# EAGLE design PressureSensor-Breakout-v0 (EAGLE 9.6.2)
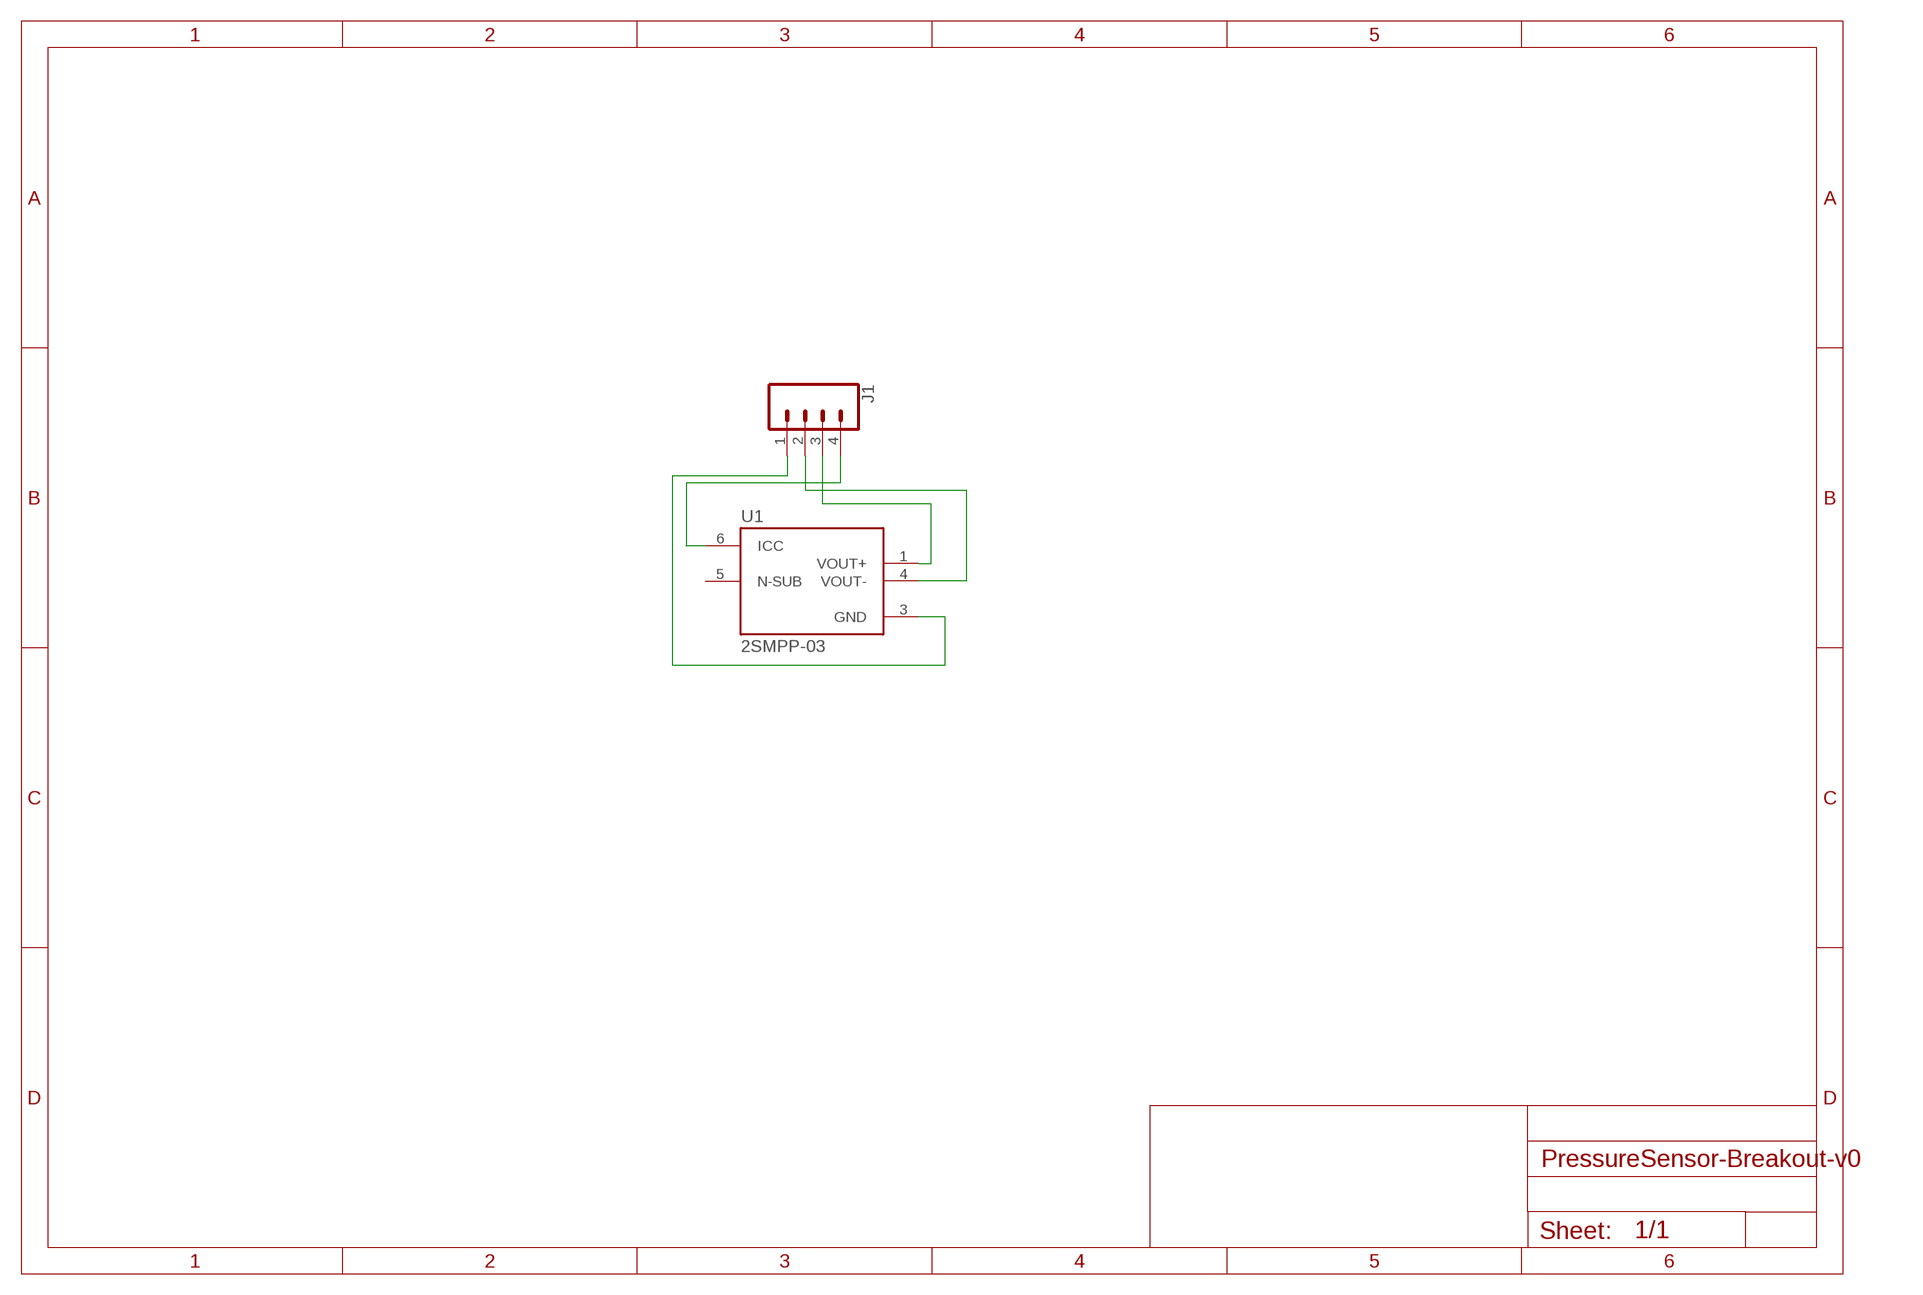
[diagram p0: schematic, sheet 1]

## Parts
J1  CONN_04  [1X04]
U1  2SMPP-03  [XDCR_2SMPP-03]

## Nets
N$1 [JLC PCB]: J1.2 U1.4(VOUT-)
N$2 [JLC PCB]: J1.4 U1.6(ICC)
N$3 [JLC PCB]: J1.1 U1.3(GND)
N$4 [JLC PCB]: J1.3 U1.1(VOUT+)
Unconnected: U1.5(N-SUB)

## Library data of the parts
J1 = ULN2803ADW:CONN_04: Multi connection point. Often used as Generic Header-pin footprint for 0.1 inch spaced/style header connections On any of the 0.1 inch spaced packages, you can populate with these: Break Away Headers - Straight <https://www.sparkfun.com/products/116> (PRT-00116) Break Away Male Headers - Right Angle <https://www.sparkfun.com/products/553> (PRT-00553) Female Headers <https://www.sparkfun.com/products/115> (PRT-00115) Break Away Headers - Machine Pin <https://www.sparkfun.com/products/117> (PRT-00117) Break Away Female Headers - Swiss Machine Pin <https://www.sparkfun.com/products/743> (PRT-00743) For SCREWTERMINALS and SPRING TERMINALS visit here: Screw Terimnals on SparkFun.com <https://www.sparkfun.com/search/results?term=Screw+Terminals> (5mm/3.5mm/2.54mm spacing) This device is also useful as a general connection point to wire up your design to another part of your project. Our various solder wires solder well into these plated through hole pads. Hook-Up Wire - Assortment (Stranded, 22 AWG) <https://www.sparkfun.com/products/11375> (PRT-11375) Hook-Up Wire - Assortment (Solid Core, 22 AWG) <https://www.sparkfun.com/products/11367> (PRT-11367) View the entire wire category on our website here <https://www.sparkfun.com/categories/141> Special notes: Molex polarized connector foot print use with SKU : PRT-08231 with associated crimp pins and housings. 1MM SMD Version SKU: PRT-10208; PROD_ID: CONN-09696
U1 = 2SMPP-03:2SMPP-03: Sensor: pressure; Range: -50÷50kPa; referential; -10÷85°C Check prices <https://pricing.snapeda.com/parts/2SMPP-03/Omron%20Electronics/view-part?ref=eda>; AVAILABILITY: Warning; DESCRIPTION: Pressure Sensor ±7.25PSI (±50kPa) Compound Male - 0.1 (2.59mm) Tube -43 mV ~ 42 mV 6-SMD Module; MF: Omron Electronics; MP: 2SMPP-03; PACKAGE: SOP-6 Omron; PRICE: None

## Net classes
1 JLC PCB: width 0.2 mm, drill 0.3 mm, clearance 0.2 mm to class 0

## Board
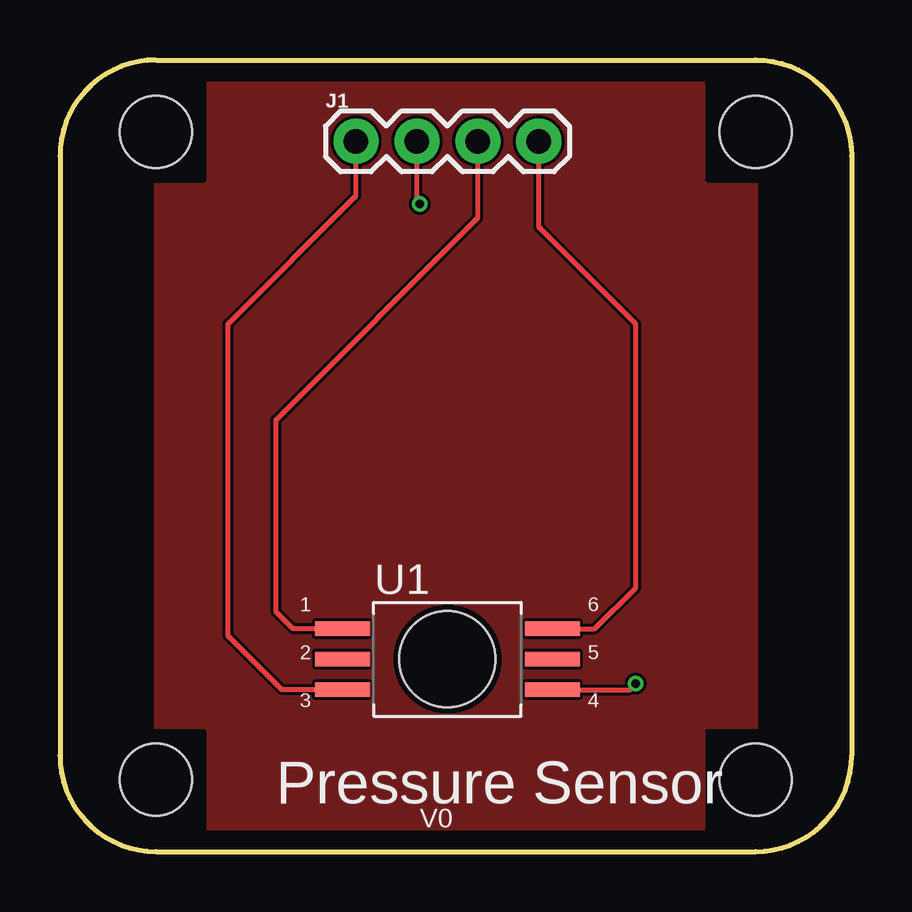
[diagram p1: board, top side]
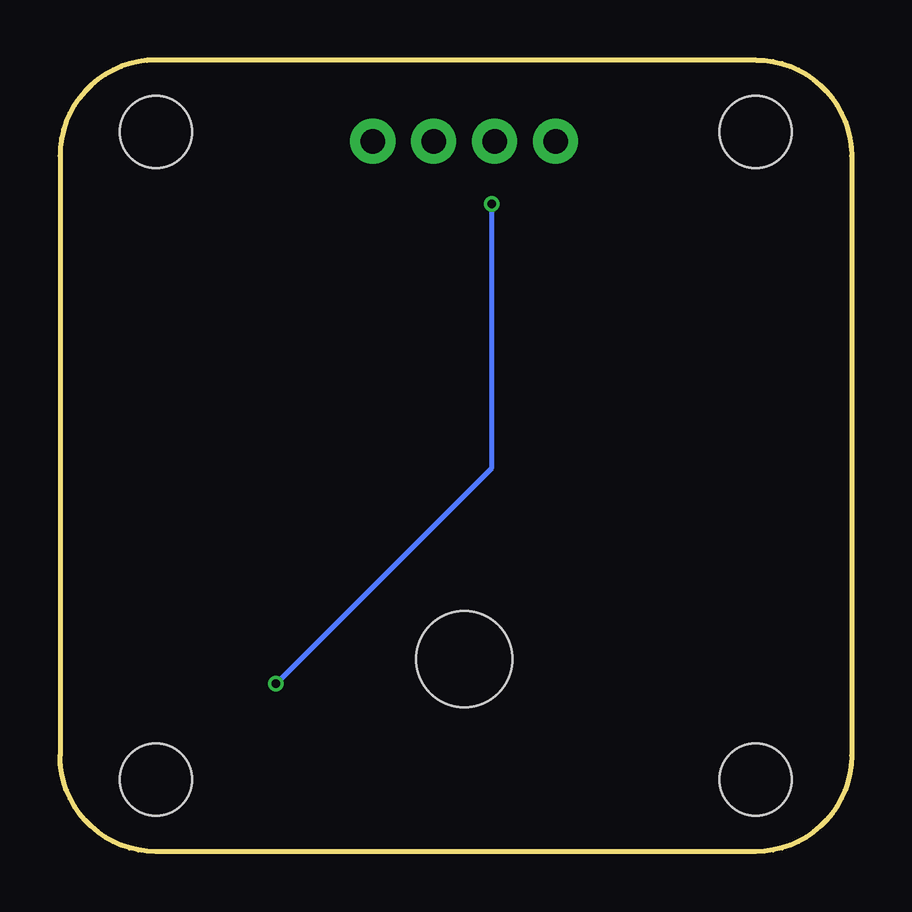
[diagram p2: board, bottom side, seen from below]

Size 33 x 33 mm. Coordinates in mm from the lower left corner, seen from the top.
Outline: 33,29 33,4 arc-90 29,0 4,0 arc-90 0,4 0,29 arc-90 4,33 29,33 arc-90 33,29
Copper layers (1*16): Top 0.035mm / dielectric 1.5mm / Bottom 0.035mm
Design rules "JLCPCB_2layer_DRU_no_angle_5mil": minimum track width 5mil, minimum drill 0.3mm, track to track 5mil, track to pad 5mil, pad to pad 5mil, via to via 5mil, smd to smd 0mil, copper to edge 10mil, drill to drill 10mil, minimum pad ring 10mil, minimum via ring 6mil, stop-mask expansion 2mil, vias tented up to drill 100mil, thermal gap 10mil
Holes 3 mm at 4,30 29,30 4,3 29,3
tRestrict: area 2,28 to 6,32; area 27,28 to 31,32; area 2,1 to 6,5; area 27,1 to 31,5

### Footprints (pad centres in the part's own frame; a part is rotated, then mirrored left to right if it is on the bottom)
1X04 = drill 1.016 pad 1.88: 1 0,0; 2 2.54,0; 3 5.08,0; 4 7.62,0
XDCR_2SMPP-03 = smd 2.3 x 0.6: 1 -4.375,1.27; 2 -4.375,0; 3 -4.375,-1.27; 4 4.375,-1.27; 5 4.375,0; 6 4.375,1.27 | hole 4: 0,0

### Placement (x,y rotation side)
J1  12.34,29.61 0 top
U1  16.15,8.02 0 top

### Tracks (layer width: path | path; a pad name or v marks a point on that pad's centre or on a via)
GND
  pour Top: 4,32 4,1 29,1 29,32
N$1  (via drill 0.35)
  Top 0.2: U1.4 23.75,6.75 v24,7 | v15,27 14.88,27.12 J1.2
  Bottom 0.2: v24,7 15,16 v15,27
N$2
  Top 0.2: U1.6 22.29,9.29 24,11 24,22 19.96,26.04 J1.4
N$3
  Top 0.2: U1.3 9.25,6.75 7,9 7,22 12.34,27.34 J1.1
N$4
  Top 0.2: U1.1 9.71,9.29 9,10 9,18 17.42,26.42 J1.3

### Text on the board
tPlace: 1 | 6 | 2 | 5 | 3 | 4 | Pressure Sensor | V0